# Altium schematic sheet Power_Sys_Toplvl.SchDoc
size A2
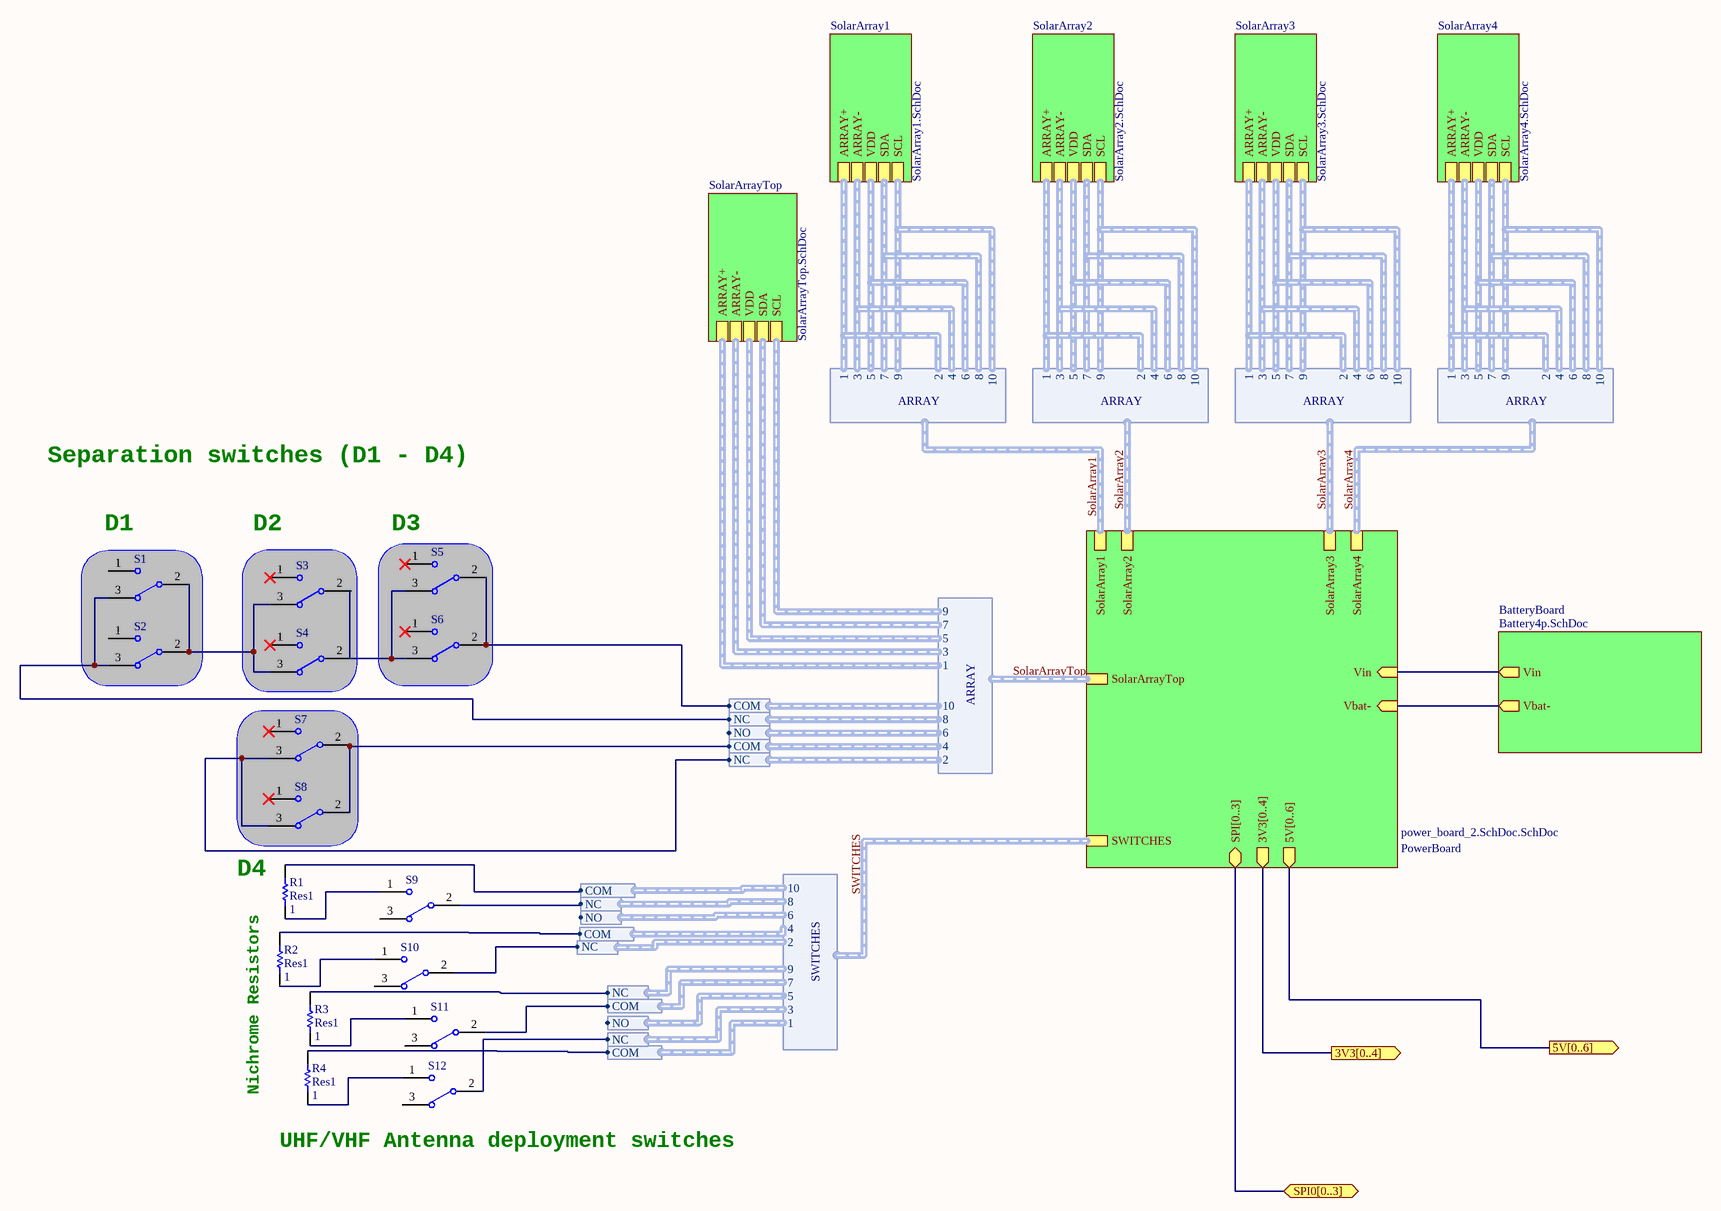
[diagram p0: Power_Sys_Toplvl.SchDoc]

## Parts
R1  Res1  value 1  [AXIAL-0.3]
R2  Res1  value 1  [AXIAL-0.3]
R3  Res1  value 1  [AXIAL-0.3]
R4  Res1  value 1  [AXIAL-0.3]
S1  SW-SPDT  [TL36WW15050]  (value not drawn)
S2  SW-SPDT  [TL36WW15050]  (value not drawn)
S3  SW-SPDT  [TL36WW15050]  (value not drawn)
S4  SW-SPDT  [TL36WW15050]  (value not drawn)
S5  SW-SPDT  [TL36WW15050]  (value not drawn)
S6  SW-SPDT  [TL36WW15050]  (value not drawn)
S7  SW-SPDT  [TL36WW15050]  (value not drawn)
S8  SW-SPDT  [TL36WW15050]  (value not drawn)
S9  SW-SPDT  [TL36WW15050]  (value not drawn)
S10  SW-SPDT  [TL36WW15050]  (value not drawn)
S11  SW-SPDT  [TL36WW15050]  (value not drawn)
S12  SW-SPDT  [TL36WW15050]  (value not drawn)

## Blocks framed on the sheet
D1: S1 S2
D2: S3 S4
D3: S5 S6

## Sub-sheets
BatteryBoard = Battery4p.SchDoc: Vbat- (out), Vin (out)
PowerBoard = power_board_2.SchDoc.SchDoc: SPI[0..3] (bidir), SolarArray1 (harness ARRAY), SolarArray2 (harness ARRAY), SolarArray3 (harness ARRAY), SolarArray4 (harness ARRAY), SolarArrayTop (harness ARRAY), SWITCHES (harness SWITCHES), Vin (in), Vbat- (in), 3V3[0..4] (out), 5V[0..6] (out)
SolarArray1 = SolarArray1.SchDoc: ARRAY+ (harness ARRAY+), ARRAY- (harness ARRAY-), VDD (harness VDD), SDA (harness SDA), SCL (harness SCL)
SolarArray2 = SolarArray2.SchDoc: ARRAY+ (harness ARRAY+), ARRAY- (harness ARRAY-), VDD (harness VDD), SDA (harness SDA), SCL (harness SCL)
SolarArray3 = SolarArray3.SchDoc: ARRAY+ (harness ARRAY+), ARRAY- (harness ARRAY-), VDD (harness VDD), SDA (harness SDA), SCL (harness SCL)
SolarArray4 = SolarArray4.SchDoc: ARRAY+ (harness ARRAY+), ARRAY- (harness ARRAY-), VDD (harness VDD), SDA (harness SDA), SCL (harness SCL)
SolarArrayTop = SolarArrayTop.SchDoc: ARRAY+ (harness ARRAY+), ARRAY- (harness ARRAY-), VDD (harness VDD), SDA (harness SDA), SCL (harness SCL)

## Ports
3V3[0..4] (out), 5V[0..6] (out), SPI0[0..3] (bidir)

## Harnesses
ARRAY: 1, 3, 5, 7, 9, 2, 4, 6, 8, 10
ARRAY: 1, 10, 2, 3, 4, 5, 6, 7, 8, 9
SEPCOM: COM
SEPNC: NC
COM: COM
NC: NC
NO: NC
NO: NO
SWITCHES: 1, 10, 2, 3, 4, 5, 6, 7, 8, 9

## Nets
NetR1_1: R1.1 S9.1
NetR1_2: R1.2 ; harness COM.COM
NetR2_1: R2.1 S10.1
NetR2_2: R2.2 ; harness COM.COM
NetR3_1: R3.1 S11.1
NetR3_2: R3.2 ; harness NO.NC
NetR4_1: R4.1 S12.1
NetR4_2: R4.2 ; harness COM.COM
NetS1_2: S1.2 S2.2 S3.3 S4.3
NetS1_3: S1.3 S2.3 ; harness SEPNC.NC
NetS4_2: S4.2 S5.3 S6.3
NetS5_2: S5.2 S6.2 ; harness SEPCOM.COM
NetS7_2: S7.2 S8.2 ; harness SEPCOM.COM
NetS7_3: S7.3 S8.3 ; harness SEPNC.NC
NetS9_2: S9.2 ; harness NC.NC
NetS10_2: S10.2 ; harness NC.NC
NetS11_2: S11.2 ; harness COM.COM
NetS12_2: S12.2 ; harness NC.NC
(unnamed): sheet PowerBoard/Vin, sheet BatteryBoard/Vin
(unnamed): sheet PowerBoard/Vbat-, sheet BatteryBoard/Vbat-

Not connected (* = marked no-connect by the designer): S1 1; S2 1; S3 1* 2; S4 1*; S5 1*; S6 1*; S7 1*; S8 1*; S9 3; S10 3; S11 3; S12 3

## Buses and harness runs
bus port 3V3[0..4] = sheet PowerBoard/3V3[0..4]
bus port 5V[0..6] = sheet PowerBoard/5V[0..6]
bus port SPI0[0..3] = sheet PowerBoard/SPI[0..3]
harness SolarArray1 = sheet PowerBoard/SolarArray1
harness SolarArray2 = sheet PowerBoard/SolarArray2
harness SolarArray3 = sheet PowerBoard/SolarArray3
harness SolarArray4 = sheet PowerBoard/SolarArray4
harness SolarArrayTop = sheet PowerBoard/SolarArrayTop
harness SWITCHES = sheet PowerBoard/SWITCHES

## Notes on the sheet
- Separation switches (D1 - D4)
- (near R1) D4
- (near R2) Nichrome Resistors
- UHF/VHF Antenna deployment switches

## Library data of the parts
R1-R4 = Res1: Resistor; Published: 8-Jun-2000; LatestRevisionDate: 17-Jul-2002; LatestRevisionNote: Re-released for DXP Platform.; PackageReference: AXIAL-0.3; Publisher: Altium Limited; PackageDescription: Axial Device, Thru-Hole; 2 Leads; 0.3 in Pin Spacing
S1-S12 = SW-SPDT: SPDT Subminiature Toggle Switch, Right Angle Mounting, Vertical Actuation; Published: 24-Mar-1999; LatestRevisionDate: 17-Dec-2003; LatestRevisionNote: Schematic revised, PCB Footprint replaced.; DatasheetVersion: 05-Dec-2000; PackageReference: TL36WW15050; Publisher: Altium Limited; PackageDescription: Switch; 4 Leads; ComponentLink1Description: Manufacturer Link; ComponentLink1URL: http://www.apem.com; Supplier 1: Digi-Key; Supplier Part Number 1: 255-3400-ND